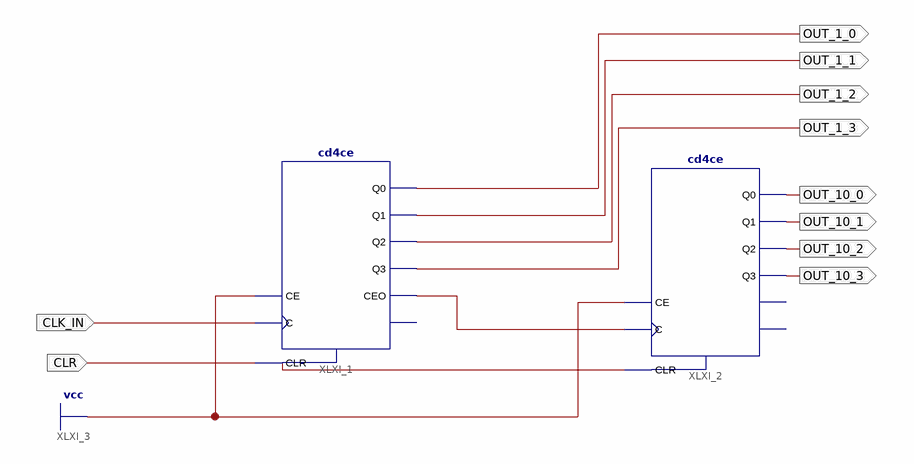
[diagram p0: schematic sheet 1]
// Xilinx ISE schematic COUNTER.sch (spartan6) as structural Verilog: 2 symbols, 10 ports
module COUNTER (
  input  CLK_IN,
  input  CLR,
  output OUT_1_0,
  output OUT_1_1,
  output OUT_1_2,
  output OUT_1_3,
  output OUT_10_0,
  output OUT_10_1,
  output OUT_10_2,
  output OUT_10_3
);

  wire XLXN_1, XLXN_4;

  cd4ce XLXI_1 (
    .C(CLK_IN), .CE(1'b1), .CLR(CLR), .CEO(XLXN_1), .Q0(OUT_1_0), .Q1(OUT_1_1), .Q2(OUT_1_2), .Q3(OUT_1_3));  // open: TC
  cd4ce XLXI_2 (
    .C(XLXN_1), .CE(1'b1), .CLR(XLXN_4), .Q0(OUT_10_0), .Q1(OUT_10_1), .Q2(OUT_10_2), .Q3(OUT_10_3));  // open: CEO, TC
endmodule
